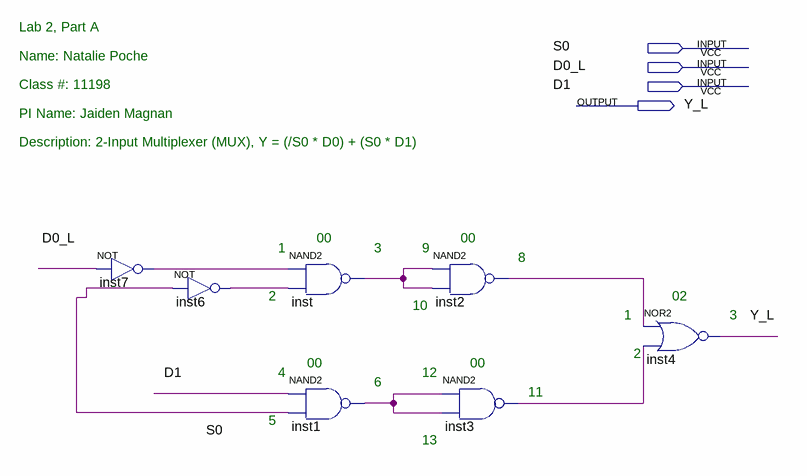
[diagram p0: schematic sheet]
// Quartus schematic lab2_2inMUX.bdf as structural Verilog: 7 symbols, 4 pins
module lab2_2inMUX (
  input  S0,
  input  D0_L,
  input  D1,
  output Y_L
);

  wire inst1_out, inst2_out, inst3_out, inst6_out, inst7_out, inst_out;

  not inst7 (inst7_out, D0_L);
  not inst6 (inst6_out, S0);
  nand inst (inst_out, inst7_out, inst6_out);
  nand inst1 (inst1_out, D1, S0);
  nand inst2 (inst2_out, inst_out, inst_out);
  nand inst3 (inst3_out, inst1_out, inst1_out);
  nor inst4 (Y_L, inst2_out, inst3_out);

  // Notes on the sheet:
  //   Lab 2, Part A
  //   Name: Natalie Poche
  //   Class #: 11198
  //   PI Name: Jaiden Magnan
  //   Description: 2-Input Multiplexer (MUX), Y = (/S0 * D0) + (S0 * D1)
  //   00
  //   00
  //   1
  //   3
  //   9
  //   8
  //   2
  //   02
  //   10
  //   1
  //   3
  //   2
  //   00
  //   00
  //   4
  //   12
  //   6
  //   11
  //   5
  //   13
endmodule
